# Altium schematic sheet JTAG.SchDoc
size A4; SheetNumber: 5; SheetTotal: 10
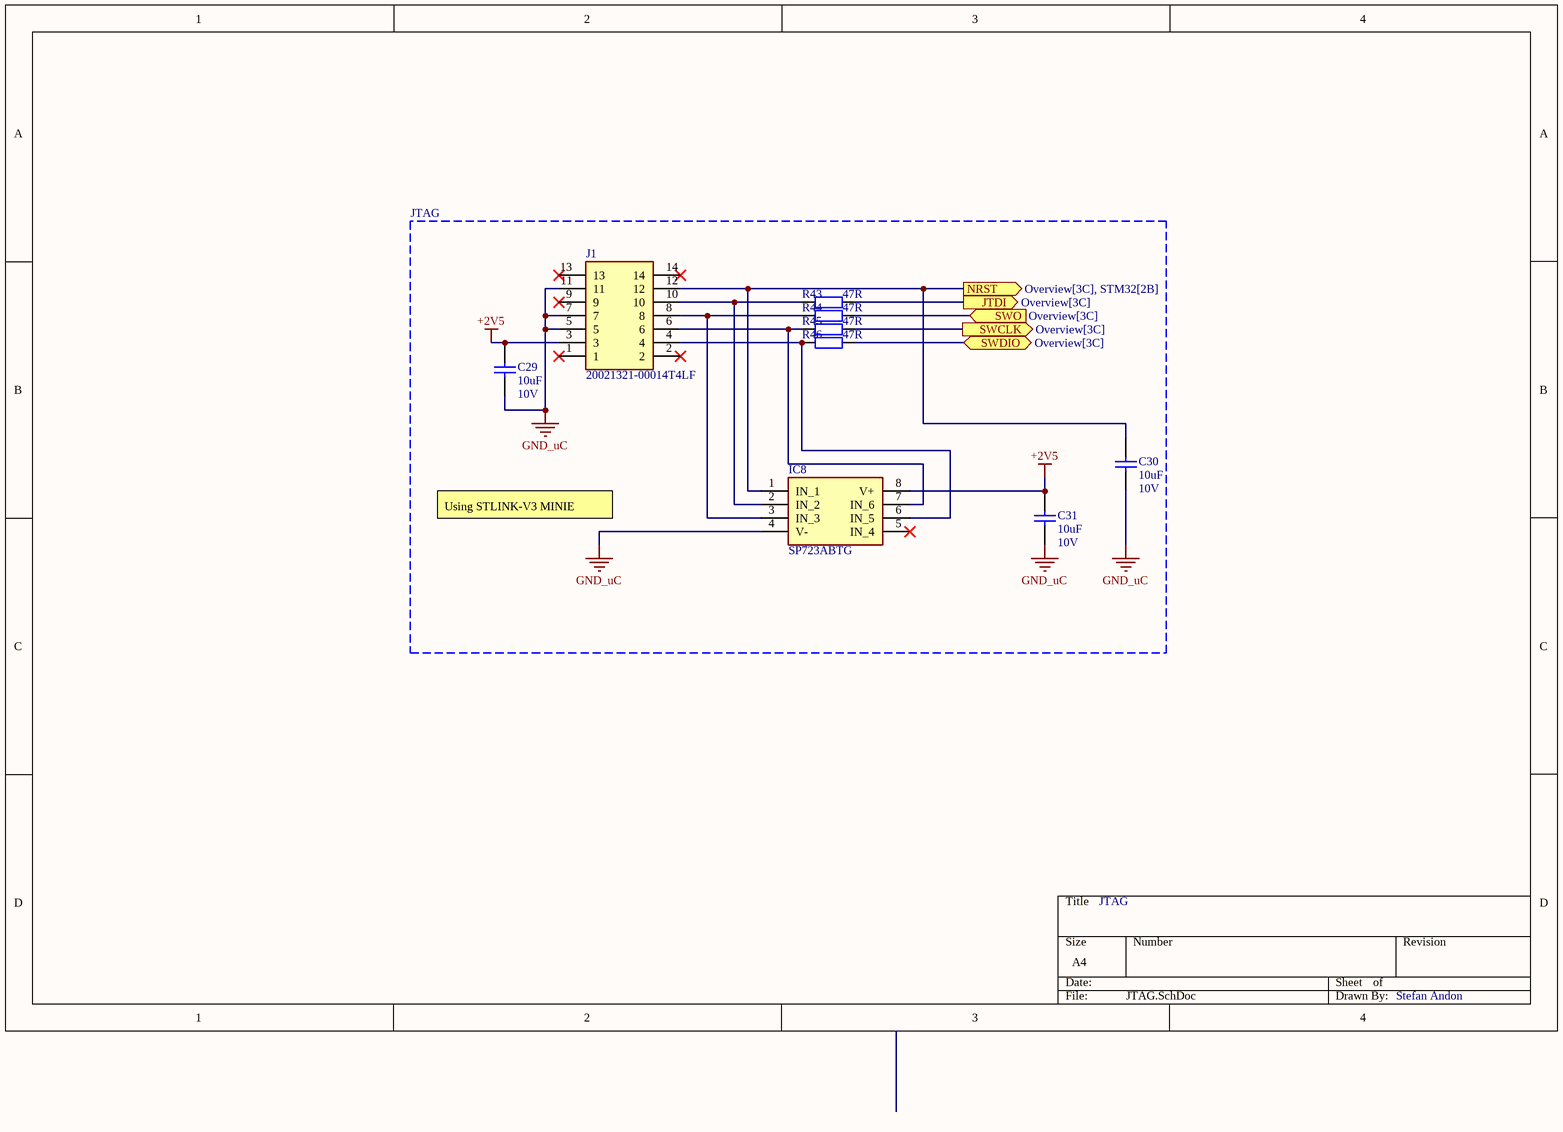
[diagram p0: JTAG.SchDoc]

## Parts
C29  value 10uF  Voltage: 10V  [CAP_0603]  (hidden comment: Capacitor_SMD)
C30  value 10uF  Voltage: 10V  [CAP_0603]  (hidden comment: Capacitor_SMD)
C31  value 10uF  Voltage: 10V  [CAP_0603]  (hidden comment: Capacitor_SMD)
IC8  SP723ABTG  [SOIC127P600X175-8N]
J1  20021321-00014T4LF  [2002132100014T4LF]
R43  value 47R  [RES_0603]  (hidden comment: Resistor_SMD)
R44  value 47R  [RES_0603]  (hidden comment: Resistor_SMD)
R45  value 47R  [RES_0603]  (hidden comment: Resistor_SMD)
R46  value 47R  [RES_0603]  (hidden comment: Resistor_SMD)

## Blocks framed on the sheet
JTAG: C29-C31 IC8 J1 R43-R46

## Ports
JTDI (out, see Overview[3C]), NRST (out, see Overview[3C], STM32[2B]), SWCLK (out, see Overview[3C]), SWDIO (bidir, see Overview[3C]), SWO (in, see Overview[3C])

## Nets
+2V5: C29.1 C31.1 IC8.8(V+) J1.3
GND_uC: C29.2 C30.2 C31.2 IC8.4(V-) J1.5 J1.7 J1.11
JTDI: R43.1 ; port JTDI
NRST: C30.1 IC8.1(IN_1) J1.12 ; port NRST
SWCLK: R45.1 ; port SWCLK
SWDIO: R46.1 ; port SWDIO
SWO: R44.1 ; port SWO
NetIC8_2: IC8.2(IN_2) J1.10 R43.2
NetIC8_3: IC8.3(IN_3) J1.8 R44.2
NetIC8_6: IC8.6(IN_5) J1.4 R46.2
NetIC8_7: IC8.7(IN_6) J1.6 R45.2

Not connected (* = marked no-connect by the designer): IC8 5(IN_4)*; J1 1* 2* 9* 13* 14*

## Notes on the sheet
- Using STLINK-V3 MINIE
- JTAG
- Stefan Andon

## Library data of the parts
C29-C31 = CMP-001-0004-13: SMD Capacitor; Tolerance: tbd; BOM: 10uF, 10V, tbd, tbd,CAP_0603; Dielectric: tbd; Package: tbd
IC8 = SP723ABTG: Integrated Circuit; Manufacturer_Name: LITTELFUSE; Datasheet Link: https://www.littelfuse.com/~/media/electronics/datasheets/tvs_diode_arrays/littelfuse_tvs_diode_array_sp723_datasheet.pdf.pdf; Height: 1.75mm; Manufacturer_Part_Number: SP723ABTG; Mouser Part Number: 576-SP723ABTG; Mouser Price/Stock: https://www.mouser.co.uk/ProductDetail/Littelfuse/SP723ABTG?qs=RnOBYWd%2Fz7ekbxzWCa4D1g%3D%3D; Arrow Part Number: SP723ABTG; Arrow Price/Stock: https://www.arrow.com/en/products/sp723abtg/littelfuse?region=nac
J1 = 20021321-00014T4LF: Connector; Manufacturer_Name: Amphenol; Datasheet Link: https://cdn.amphenol-cs.com/media/wysiwyg/files/drawing/20021321.pdf; Height: 4.65mm; Manufacturer_Part_Number: 20021321-00014T4LF; Mouser Part Number: 649-221321-00014T4LF; Mouser Price/Stock: https://www.mouser.co.uk/ProductDetail/Amphenol-FCI/20021321-00014T4LF?qs=oJs1R%252BxK6kRZfo0i005jmw%3D%3D
R43-R46 = CMP-001-0003-18: Tolerance: tbd; Power: 7W; BOM: Value+', '+Power+', '+Tolerance+', '+CurrentFootprint; Package: tbd